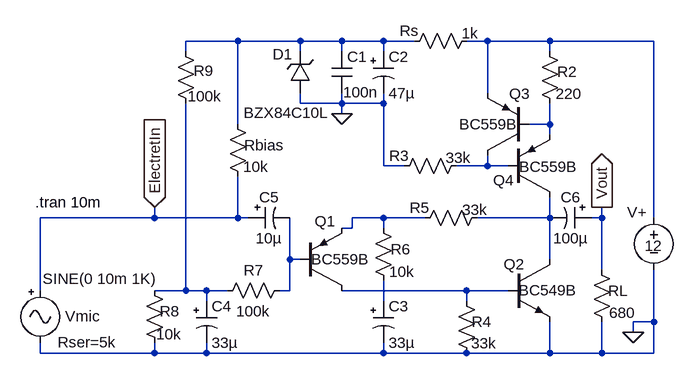
[diagram p0: schematic MicPre.asc]
MicPre.asc, the LTspice schematic file:
Version 4
SHEET 1 880 680
WIRE -256 96 -336 96
WIRE -160 96 -256 96
WIRE -96 96 -160 96
WIRE -32 96 -96 96
WIRE 16 96 -32 96
WIRE 128 96 96 96
WIRE 224 96 128 96
WIRE 384 96 224 96
WIRE -336 112 -336 96
WIRE -160 112 -160 96
WIRE -96 112 -96 96
WIRE -32 112 -32 96
WIRE 224 112 224 96
WIRE 128 176 128 96
WIRE -160 192 -160 176
WIRE -96 192 -96 176
WIRE -96 192 -160 192
WIRE -32 192 -32 176
WIRE -32 192 -96 192
WIRE -96 208 -96 192
WIRE -256 224 -256 96
WIRE 224 224 224 192
WIRE 224 224 192 224
WIRE 224 240 224 224
WIRE -32 288 -32 192
WIRE 0 288 -32 288
WIRE 128 288 128 272
WIRE 128 288 80 288
WIRE 160 288 128 288
WIRE -384 368 -384 352
WIRE -384 368 -560 368
WIRE -256 368 -256 304
WIRE -256 368 -384 368
WIRE -240 368 -256 368
WIRE -32 368 -80 368
WIRE 32 368 -32 368
WIRE 224 368 224 336
WIRE 224 368 112 368
WIRE 304 368 304 352
WIRE 304 368 288 368
WIRE 384 368 384 96
WIRE -80 384 -80 368
WIRE -80 384 -96 384
WIRE -32 384 -32 368
WIRE -176 432 -176 368
WIRE -160 432 -176 432
WIRE 224 432 224 368
WIRE 304 448 304 368
WIRE -560 480 -560 368
WIRE -336 480 -336 192
WIRE -336 480 -384 480
WIRE -304 480 -336 480
WIRE -272 480 -304 480
WIRE -176 480 -176 432
WIRE -176 480 -192 480
WIRE 96 480 -96 480
WIRE 160 480 96 480
WIRE -304 496 -304 480
WIRE -32 496 -32 464
WIRE 96 496 96 480
WIRE 384 528 384 448
WIRE 384 528 352 528
WIRE 352 544 352 528
WIRE -560 576 -560 560
WIRE -384 576 -384 560
WIRE -384 576 -560 576
WIRE -304 576 -304 560
WIRE -304 576 -384 576
WIRE -32 576 -32 560
WIRE -32 576 -304 576
WIRE 96 576 -32 576
WIRE 224 576 224 528
WIRE 224 576 96 576
WIRE 304 576 304 528
WIRE 304 576 224 576
WIRE 384 576 384 528
WIRE 384 576 304 576
FLAG 352 544 0
FLAG -384 352 ElectretIn
IOPIN -384 352 In
FLAG -96 208 0
FLAG 304 352 Vout
IOPIN 304 352 Out
SYMBOL pnp2 -160 480 M180
WINDOW 0 22 107 Left 0
WINDOW 3 17 48 Left 0
SYMATTR InstName Q1
SYMATTR Value BC559B
SYMBOL Miscel\\npn2 160 432 R0
WINDOW 0 -7 7 Left 0
WINDOW 3 16 47 Left 0
SYMATTR InstName Q2
SYMATTR Value BC549B
SYMBOL Miscel\\zener -144 176 R180
WINDOW 0 28 60 Left 0
WINDOW 3 -28 -30 Left 0
SYMATTR InstName D1
SYMATTR Value BZX84C10L
SYMBOL cap -112 112 R0
WINDOW 3 18 63 Left 0
SYMATTR Value 100n
SYMATTR InstName C1
SYMBOL polcap -48 112 R0
WINDOW 3 24 64 Left 0
SYMATTR Value 47µ
SYMATTR InstName C2
SYMATTR Description Capacitor
SYMATTR Type cap
SYMATTR SpiceLine V=63 Irms=600m Rser=0.13 MTBF=20000 Lser=0 mfg="Nichicon" pn="UPH1J470MRH" type="Al electrolytic" ppPkg=1
SYMBOL res 112 80 R90
WINDOW 0 16 104 VBottom 0
WINDOW 3 -12 11 VTop 0
SYMATTR InstName Rs
SYMATTR Value 1k
SYMBOL pnp2 192 272 R180
WINDOW 0 -2 95 Left 0
WINDOW 3 18 48 Left 0
SYMATTR InstName Q3
SYMATTR Value BC559B
SYMBOL pnp2 160 336 M180
WINDOW 0 -23 26 Left 0
WINDOW 3 17 47 Left 0
SYMATTR InstName Q4
SYMATTR Value BC559B
SYMBOL res 208 96 R0
WINDOW 0 27 47 Left 0
WINDOW 3 25 81 Left 0
SYMATTR InstName R2
SYMATTR Value 220
SYMBOL res 96 272 R90
WINDOW 0 16 104 VBottom 0
WINDOW 3 -12 13 VTop 0
SYMATTR InstName R3
SYMATTR Value 33k
SYMBOL res 80 480 R0
WINDOW 0 24 48 Left 0
WINDOW 3 23 81 Left 0
SYMATTR InstName R4
SYMATTR Value 33k
SYMBOL res 128 352 R90
WINDOW 0 16 104 VBottom 0
WINDOW 3 -12 19 VTop 0
SYMATTR InstName R5
SYMATTR Value 33k
SYMBOL res -48 368 R0
WINDOW 0 27 48 Left 0
WINDOW 3 25 83 Left 0
SYMATTR InstName R6
SYMATTR Value 10k
SYMBOL polcap -48 496 R0
WINDOW 3 24 64 Left 0
SYMATTR Value 33µ
SYMATTR InstName C3
SYMATTR Description Capacitor
SYMATTR Type cap
SYMATTR SpiceLine V=50 Irms=240m Rser=0.43 MTBF=2000 Lser=0 mfg="Nichicon" pn="UPL1H330MPH" type="Al electrolytic" ppPkg=1
SYMBOL res -176 464 R90
WINDOW 0 0 56 VBottom 0
WINDOW 3 32 56 VTop 0
SYMATTR InstName R7
SYMATTR Value 100k
SYMBOL polcap -320 496 R0
WINDOW 3 24 64 Left 0
SYMATTR Value 33µ
SYMATTR InstName C4
SYMATTR Description Capacitor
SYMATTR Type cap
SYMATTR SpiceLine V=50 Irms=240m Rser=0.43 MTBF=2000 Lser=0 mfg="Nichicon" pn="UPL1H330MPH" type="Al electrolytic" ppPkg=1
SYMBOL res -400 464 R0
WINDOW 0 24 48 Left 0
WINDOW 3 18 83 Left 0
SYMATTR InstName R8
SYMATTR Value 10k
SYMBOL res -352 96 R0
WINDOW 0 28 46 Left 0
WINDOW 3 19 85 Left 0
SYMATTR InstName R9
SYMATTR Value 100k
SYMBOL polcap -240 352 M90
WINDOW 0 0 32 VBottom 0
WINDOW 3 32 32 VTop 0
SYMATTR InstName C5
SYMATTR Value 10µ
SYMATTR Description Capacitor
SYMATTR Type cap
SYMATTR SpiceLine V=16 Irms=35m Rser=2.8 MTBF=1000 Lser=0 mfg="Nichicon" pn="UPR1C100MAH" type="Al electrolytic" ppPkg=1
SYMBOL res -272 208 R0
WINDOW 0 26 48 Left 0
WINDOW 3 24 81 Left 0
SYMATTR InstName Rbias
SYMATTR Value 10k
SYMBOL voltage 384 352 R0
WINDOW 0 -41 7 Left 0
WINDOW 3 -14 59 Left 0
WINDOW 123 0 0 Left 0
SYMATTR InstName V+
SYMATTR Value 12
SYMATTR SpiceLine Rser=1
SYMBOL Misc\\signal -560 464 R0
WINDOW 0 38 55 Left 0
WINDOW 3 4 -2 Left 0
WINDOW 123 0 0 Left 0
WINDOW 39 27 95 Left 0
SYMATTR InstName Vmic
SYMATTR Value SINE(0 10m 1K)
SYMATTR SpiceLine Rser=5k
SYMBOL polcap 288 352 R90
WINDOW 0 0 32 VBottom 0
WINDOW 3 32 32 VTop 0
SYMATTR InstName C6
SYMATTR Value 100µ
SYMATTR Description Capacitor
SYMATTR Type cap
SYMATTR SpiceLine V=16 Irms=265m Rser=0.35 MTBF=2000 Lser=0 mfg="Nichicon" pn="UPL1C101MPH" type="Al electrolytic" ppPkg=1
SYMBOL res 288 432 R0
WINDOW 0 26 48 Left 0
WINDOW 3 27 82 Left 0
SYMATTR InstName RL
SYMATTR Value 680
TEXT -568 344 Left 0 !.tran 10m

The netlist it stands for:
* MicPre.asc
Q1 N009 N007 N005 0 BC559B
Q2 N006 N009 0 0 BC549B
D1 0 N001 BZX84C10L
C1 N001 0 100n
C2 N001 0 47µ V=63 Irms=600m Rser=0.13 MTBF=20000 Lser=0 mfg="Nichicon" pn="UPH1J470MRH" type="Al electrolytic" ppPkg=1
Rs N002 N001 1k
Q3 N004 N003 N002 0 BC559B
Q4 N006 N004 N003 0 BC559B
R2 N002 N003 220
R3 N004 0 33k
R4 N009 0 33k
R5 N006 N005 33k
R6 N005 N010 10k
C3 N010 0 33µ V=50 Irms=240m Rser=0.43 MTBF=2000 Lser=0 mfg="Nichicon" pn="UPL1H330MPH" type="Al electrolytic" ppPkg=1
R7 N007 N008 100k
C4 N008 0 33µ V=50 Irms=240m Rser=0.43 MTBF=2000 Lser=0 mfg="Nichicon" pn="UPL1H330MPH" type="Al electrolytic" ppPkg=1
R8 N008 0 10k
R9 N001 N008 100k
C5 ElectretIn N007 10µ V=16 Irms=35m Rser=2.8 MTBF=1000 Lser=0 mfg="Nichicon" pn="UPR1C100MAH" type="Al electrolytic" ppPkg=1
Rbias N001 ElectretIn 10k
V+ N002 0 12 Rser=1
Vmic ElectretIn 0 SINE(0 10m 1K) Rser=5k
C6 Vout N006 100µ V=16 Irms=265m Rser=0.35 MTBF=2000 Lser=0 mfg="Nichicon" pn="UPL1C101MPH" type="Al electrolytic" ppPkg=1
RL Vout 0 680
.model D D
.lib standard.dio
.model NPN NPN
.model PNP PNP
.lib standard.bjt
.tran 10m
.backanno
.end